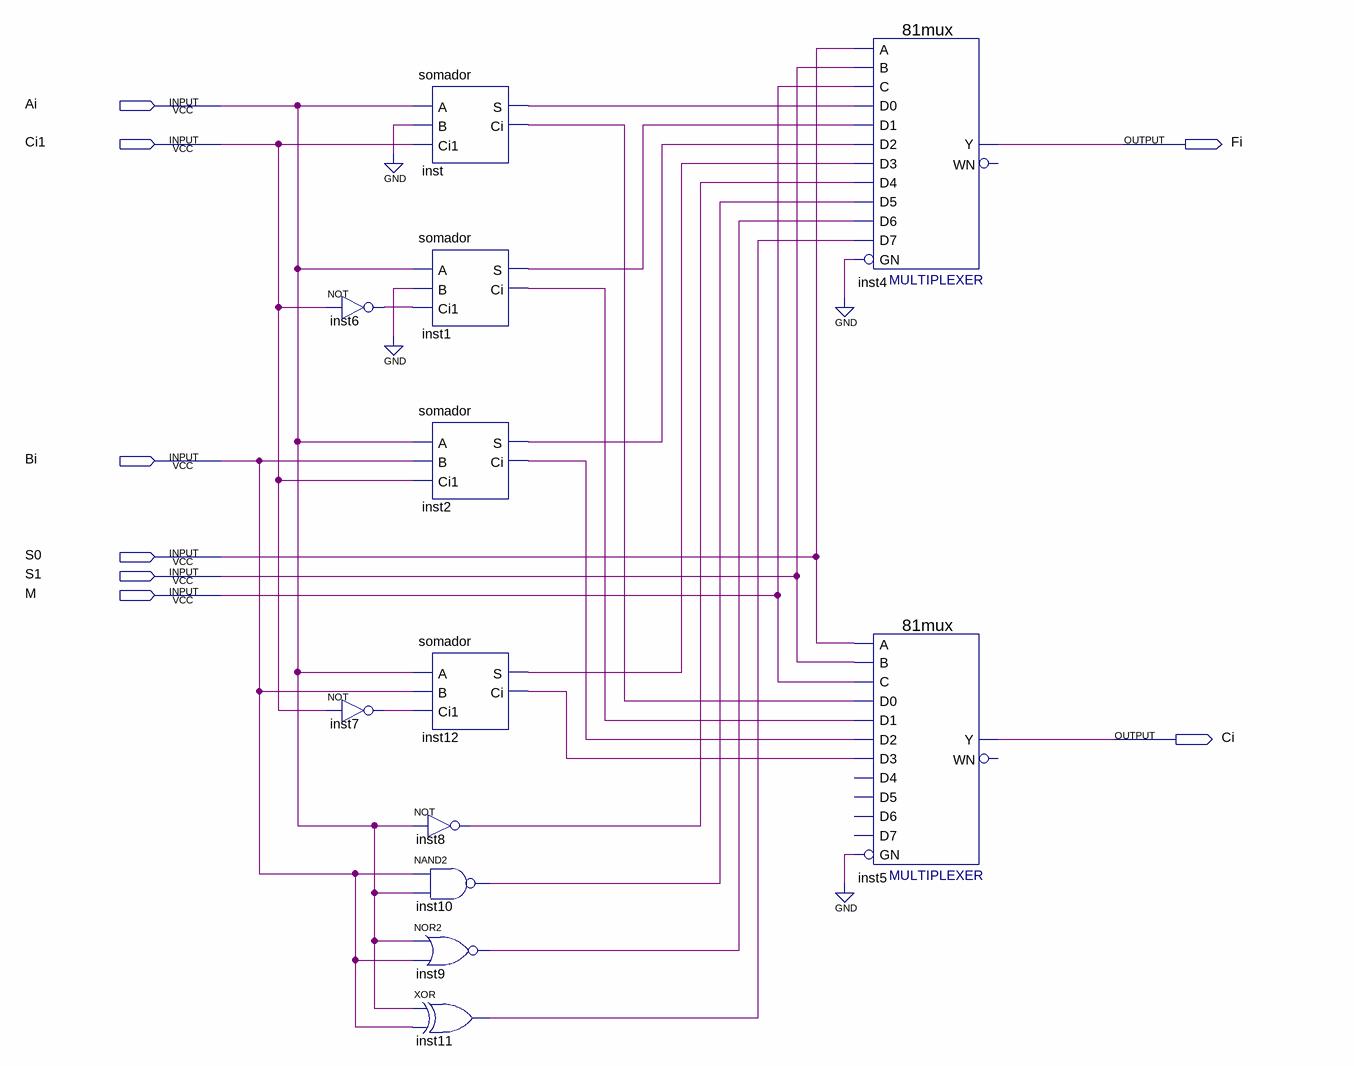
[diagram p0: schematic sheet]
// Quartus schematic Problema61.bdf as structural Verilog: 12 symbols, 8 pins
module Problema61 (
  input  Ai,
  input  Ci1,
  input  Bi,
  input  S0,
  input  S1,
  input  M,
  output Fi,
  output Ci
);

  wire inst1_ci, inst1_s, inst2_ci, inst2_s, inst6_out, inst7_out, inst8_out, inst9_out, inst10_out,
       inst11_out, inst12_ci, inst12_s, inst_ci, inst_s;

  not inst6 (inst6_out, Ci1);
  not inst7 (inst7_out, Ci1);
  somador inst (.A(Ai), .B(1'b0), .Ci1(Ci1), .S(inst_s), .Ci(inst_ci));
  somador inst1 (.A(Ai), .B(1'b0), .Ci1(inst6_out), .S(inst1_s), .Ci(inst1_ci));
  somador inst2 (.A(Ai), .B(Bi), .Ci1(Ci1), .S(inst2_s), .Ci(inst2_ci));
  somador inst12 (.A(Ai), .B(Bi), .Ci1(inst7_out), .S(inst12_s), .Ci(inst12_ci));
  not inst8 (inst8_out, Ai);
  nand inst10 (inst10_out, Bi, Ai);
  nor inst9 (inst9_out, Ai, Bi);
  xor inst11 (inst11_out, Ai, Bi);
  \81mux  inst4 (
    .C(M), .D1(inst1_s), .D0(inst_s), .D5(inst10_out), .D4(inst8_out), .D2(inst2_s), .D3(inst12_s),
    .GN(1'b0), .D7(inst11_out), .D6(inst9_out), .A(S0), .B(S1), .Y(Fi));  // open: WN
  \81mux  inst5 (
    .C(M), .D1(inst1_ci), .D0(inst_ci), .D2(inst2_ci), .D3(inst12_ci), .GN(1'b0), .A(S0), .B(S1), .Y(Ci));  // open: D5, D4, D7, D6, WN
endmodule
